# EAGLE design netconx1_v01 (EAGLE 6.5.0)
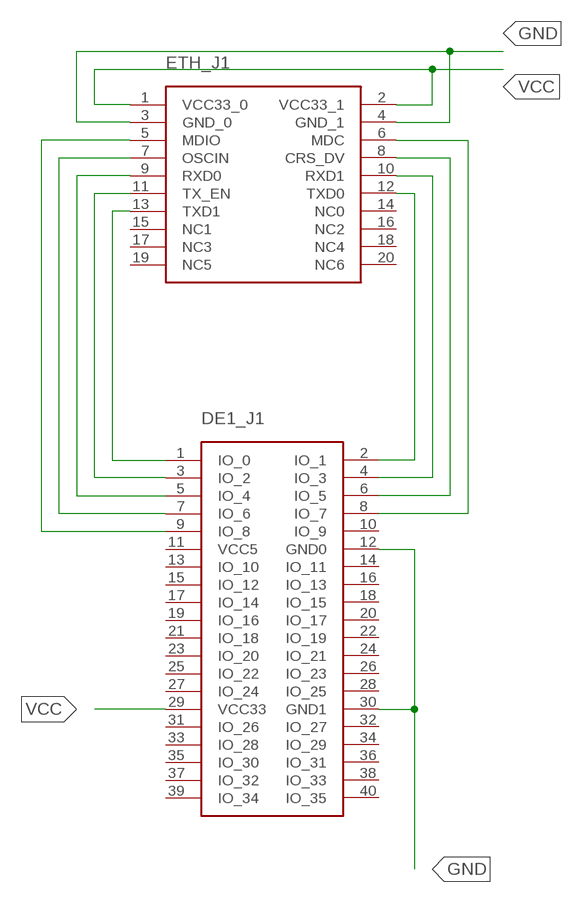
[diagram p0: schematic, sheet 1]

## Parts
DE1_J1  DE1_GPIO_CON40"  [2X20]
ETH_J1  DP83848C_ETH_BRD_CON  [2X10]

## Nets
GND: DE1_J1.12(GND0) DE1_J1.30(GND1) ETH_J1.3(GND_0) ETH_J1.4(GND_1)
N$1: DE1_J1.1(IO_0) ETH_J1.13(TXD1)
N$2: DE1_J1.3(IO_2) ETH_J1.11(TX_EN)
N$3: DE1_J1.5(IO_4) ETH_J1.9(RXD0)
N$4: DE1_J1.7(IO_6) ETH_J1.7(OSCIN)
N$5: DE1_J1.9(IO_8) ETH_J1.5(MDIO)
N$6: DE1_J1.2(IO_1) ETH_J1.12(TXD0)
N$7: DE1_J1.4(IO_3) ETH_J1.10(RXD1)
N$8: DE1_J1.6(IO_5) ETH_J1.8(CRS_DV)
N$9: DE1_J1.8(IO_7) ETH_J1.6(MDC)
VCC: DE1_J1.29(VCC33) ETH_J1.1(VCC33_0) ETH_J1.2(VCC33_1)
Unconnected: DE1_J1.10(IO_9) DE1_J1.13(IO_10) DE1_J1.14(IO_11) DE1_J1.15(IO_12) DE1_J1.16(IO_13) DE1_J1.17(IO_14) DE1_J1.18(IO_15) DE1_J1.19(IO_16) DE1_J1.20(IO_17) DE1_J1.21(IO_18) DE1_J1.22(IO_19) DE1_J1.23(IO_20) DE1_J1.24(IO_21) DE1_J1.25(IO_22) DE1_J1.26(IO_23) DE1_J1.27(IO_24) DE1_J1.28(IO_25) DE1_J1.31(IO_26) DE1_J1.32(IO_27) DE1_J1.33(IO_28) DE1_J1.34(IO_29) DE1_J1.35(IO_30) DE1_J1.36(IO_31) DE1_J1.37(IO_32) DE1_J1.38(IO_33) DE1_J1.39(IO_34) DE1_J1.40(IO_35) ETH_J1.14(NC0) ETH_J1.15(NC1) ETH_J1.16(NC2) ETH_J1.17(NC3) ETH_J1.18(NC4) ETH_J1.19(NC5) ETH_J1.20(NC6)

## Power pins joined to a net without a drawn wire
VCC5: DE1_J1.11(VCC5)

## Library data of the parts
DE1_J1 = connectors:DE1_GPIO_CON40: DE1 GPIO Connector This is the 40 pin GPIO expansion connector for DE1 board.
ETH_J1 = connectors:DP83848C_ETH_BRD_CON: DP83848C Ethernet Board Connector Connector for DP83848C board from Waveshare. http://www.wvshare.com/product/DP83848-Ethernet-Board.htm

## Board
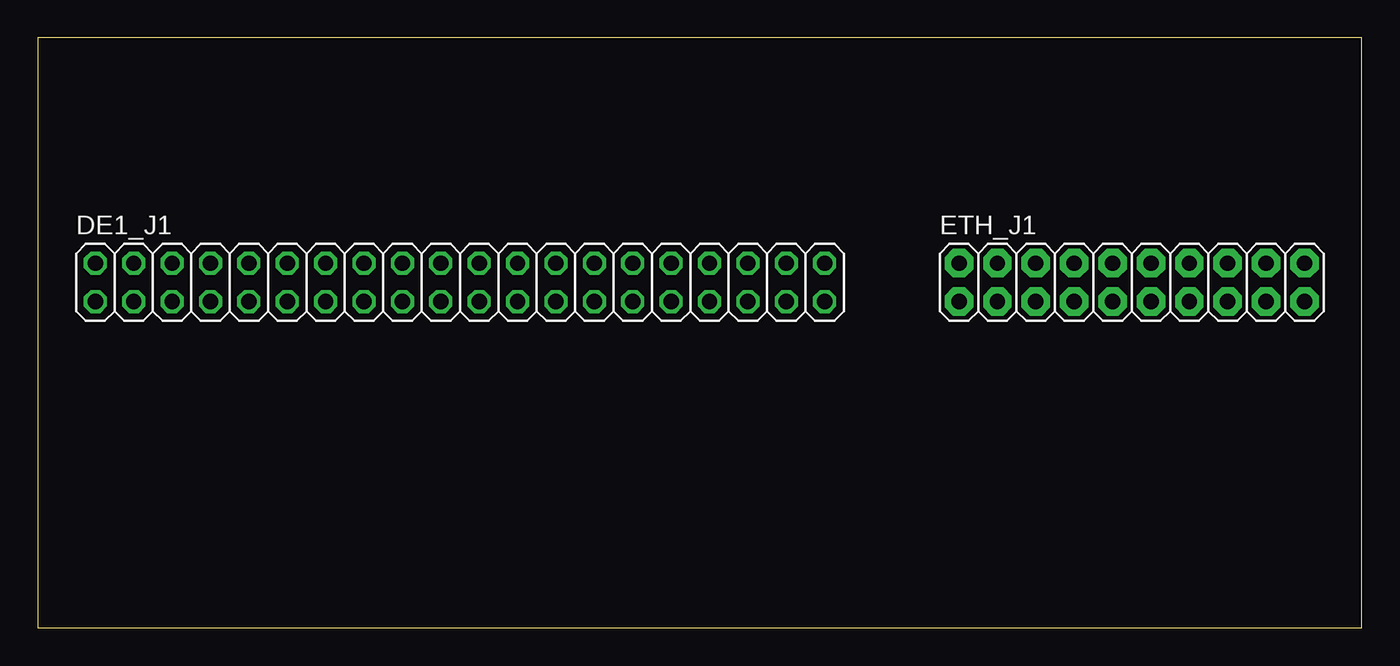
[diagram p1: board, top side]
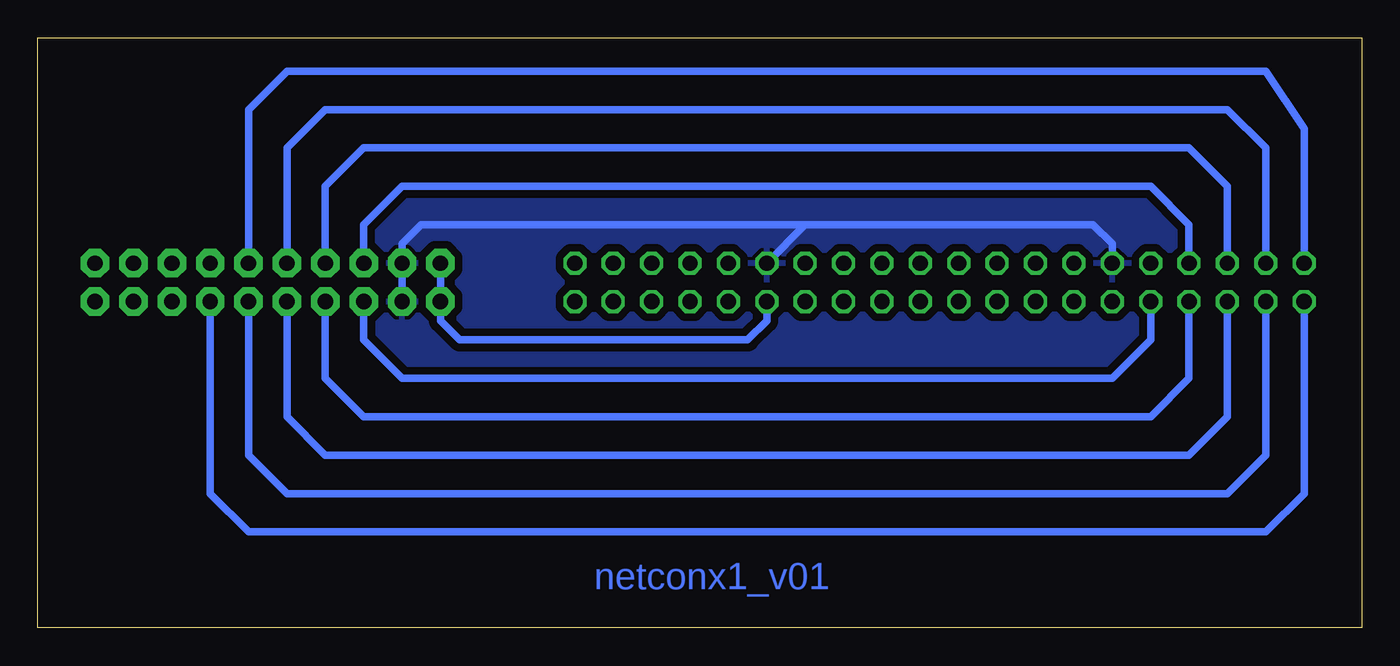
[diagram p2: board, bottom side, seen from below]

Size 87.61 x 39.04 mm. Coordinates in mm from the lower left corner, seen from the top.
Outline: 0,0 87.61,0 87.61,39.04 0,39.04 0,0
Copper layers (1*16): Top 0.035mm / dielectric 1.5mm / Bottom 0.035mm
Design rules "rules": minimum track width 20mil, minimum drill 24mil, track to track 20mil, track to pad 10mil, pad to pad 20mil, via to via 20mil, smd to smd 8mil, copper to edge 30mil, drill to drill 20mil, minimum pad ring 10mil, minimum via ring 8mil, stop-mask expansion 4mil, vias tented up to drill 0mil, thermal gap 10mil

### Footprints (pad centres in the part's own frame; a part is rotated, then mirrored left to right if it is on the bottom)
2X20 = drill 1.016 octagon: 1 -24.13,-1.27; 2 -24.13,1.27; 3 -21.59,-1.27; 4 -21.59,1.27; 5 -19.05,-1.27; 6 -19.05,1.27; 7 -16.51,-1.27; 8 -16.51,1.27; 9 -13.97,-1.27; 10 -13.97,1.27; 11 -11.43,-1.27; 12 -11.43,1.27; 13 -8.89,-1.27; 14 -8.89,1.27; 15 -6.35,-1.27; 16 -6.35,1.27; 17 -3.81,-1.27; 18 -3.81,1.27; 19 -1.27,-1.27; 20 -1.27,1.27; 21 1.27,-1.27; 22 1.27,1.27; 23 3.81,-1.27; 24 3.81,1.27; 25 6.35,-1.27; 26 6.35,1.27; 27 8.89,-1.27; 28 8.89,1.27; 29 11.43,-1.27; 30 11.43,1.27; 31 13.97,-1.27; 32 13.97,1.27; 33 16.51,-1.27; 34 16.51,1.27; 35 19.05,-1.27; 36 19.05,1.27; 37 21.59,-1.27; 38 21.59,1.27; 39 24.13,-1.27; 40 24.13,1.27
2X10 = drill 1.016 pad 1.88 octagon: 1 -11.43,-1.27; 2 -11.43,1.27; 3 -8.89,-1.27; 4 -8.89,1.27; 5 -6.35,-1.27; 6 -6.35,1.27; 7 -3.81,-1.27; 8 -3.81,1.27; 9 -1.27,-1.27; 10 -1.27,1.27; 11 1.27,-1.27; 12 1.27,1.27; 13 3.81,-1.27; 14 3.81,1.27; 15 6.35,-1.27; 16 6.35,1.27; 17 8.89,-1.27; 18 8.89,1.27; 19 11.43,-1.27; 20 11.43,1.27

### Placement (x,y rotation side)
DE1_J1  27.94,22.86 0 top
ETH_J1  72.39,22.86 0 top

### Tracks (layer width: path | path; a pad name or v marks a point on that pad's centre or on a via)
GND
  Bottom 0.508: ETH_J1.3 ETH_J1.4 63.5,25.4 62.23,26.67 36.83,26.67 | DE1_J1.12 16.51,25.4 17.78,26.67 36.83,26.67 | DE1_J1.30 36.83,26.67
  pour Bottom: -2.54,41.91 -3.81,-7.62 91.44,-7.62 92.71,41.91
N$1
  Bottom 0.508: DE1_J1.1 3.81,8.89 6.35,6.35 73.66,6.35 76.2,8.89 ETH_J1.13
N$2
  Bottom 0.508: DE1_J1.3 6.35,11.43 8.89,8.89 71.12,8.89 73.66,11.43 ETH_J1.11
N$3
  Bottom 0.508: DE1_J1.5 8.89,13.97 11.43,11.43 68.58,11.43 71.12,13.97 ETH_J1.9
N$4
  Bottom 0.508: DE1_J1.7 11.43,16.51 13.97,13.97 66.04,13.97 68.58,16.51 ETH_J1.7
N$5
  Bottom 0.508: DE1_J1.9 13.97,19.05 16.51,16.51 63.5,16.51 66.04,19.05 ETH_J1.5
N$6
  Bottom 0.508: DE1_J1.2 3.81,33.02 6.35,36.83 71.12,36.83 73.66,34.29 ETH_J1.12
N$7
  Bottom 0.508: DE1_J1.4 6.35,31.75 8.89,34.29 68.58,34.29 71.12,31.75 ETH_J1.10
N$8
  Bottom 0.508: DE1_J1.6 8.89,29.21 11.43,31.75 66.04,31.75 68.58,29.21 ETH_J1.8
N$9
  Bottom 0.508: DE1_J1.8 11.43,26.67 13.97,29.21 63.5,29.21 66.04,26.67 ETH_J1.6
VCC
  Bottom 0.508: DE1_J1.29 39.37,20.32 40.64,19.05 59.69,19.05 60.96,20.32 ETH_J1.1 ETH_J1.2

### Text on the board
Bottom: netconx1_v01